# EAGLE design FizziLagTester (EAGLE 7.5.0)
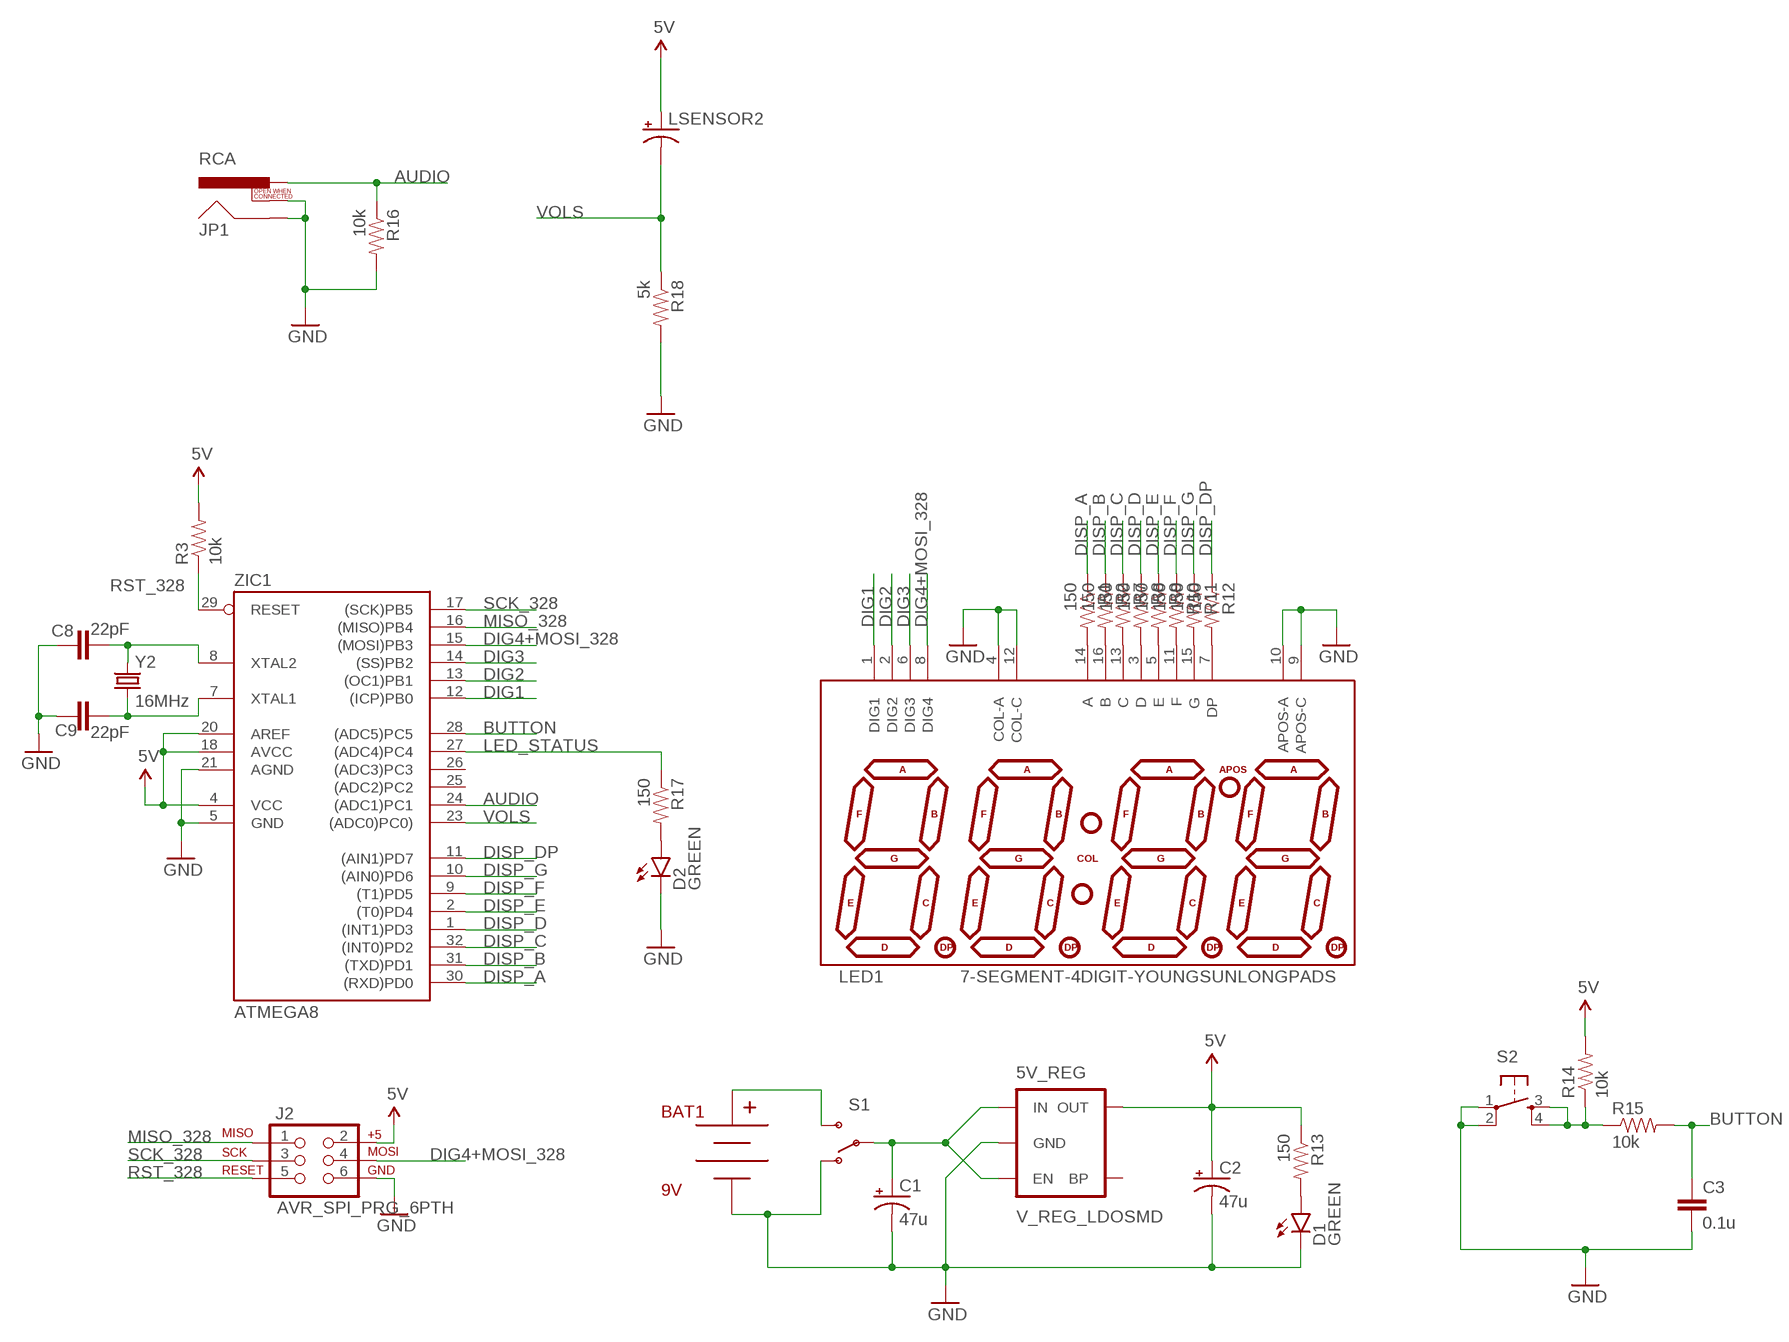
[diagram p0: schematic, sheet 1]

## Parts
5V_REG  V_REG_LDOSMD  [SOT23-5]
BAT1  9V  BC9VPC  [BC9VPC]
C1  47u  CAP_POLPTH1  [CPOL-RADIAL-100UF-25V]
C2  47u  CAP_POLPTH1  [CPOL-RADIAL-100UF-25V]
C3  0.1u  CAP0603-CAP  [0603-CAP]
C8  22pF  CAP0603-CAP  [0603-CAP]
C9  22pF  CAP0603-CAP  [0603-CAP]
D1  GREEN  LED-GREEN0603  [LED-0603]
D2  GREEN  LED-GREEN0603  [LED-0603]
J2  AVR_SPI_PRG_6PTH  [2X3]
JP1  RCA  [RCA]
LED1  7-SEGMENT-4DIGIT-YOUNGSUNLONGPADS  [7-SEGMENT-4DIGIT-YOUNGSUN-LONGPADS]
LSENSOR2  CAP_POLPTH2  [CPOL-RADIAL-10UF-25V]
R1  150  RESISTOR0603-RES  [0603-RES]
R2  150  RESISTOR0603-RES  [0603-RES]
R3  10k  RESISTOR0603-RES  [0603-RES]
R7  150  RESISTOR0603-RES  [0603-RES]
R8  150  RESISTOR0603-RES  [0603-RES]
R9  150  RESISTOR0603-RES  [0603-RES]
R10  150  RESISTOR0603-RES  [0603-RES]
R11  150  RESISTOR0603-RES  [0603-RES]
R12  150  RESISTOR0603-RES  [0603-RES]
R13  150  RESISTOR0603-RES  [0603-RES]
R14  10k  RESISTOR0603-RES  [0603-RES]
R15  10k  RESISTOR0603-RES  [0603-RES]
R16  10k  RESISTOR0603-RES  [0603-RES]
R17  150  RESISTOR0603-RES  [0603-RES]
R18  5k  RESISTOR0603-RES  [0603-RES]
S1  SWITCH-SPDTPTH  [SWITCH-SPDT]
S2  TAC_SWITCHPTH  [TACTILE-PTH]
Y2  16MHz  CRYSTALHC49US  [HC49US]
ZIC1  ATMEGA8  AT90S4433A  [TQFP32-08]

## Nets
5V: 5V_REG.5(OUT) C2.1(+) J2.2 LSENSOR2.1(+) R3.2 R13.1 R14.2 ZIC1.4(VCC) ZIC1.18(AVCC) ZIC1.20(AREF)
AUDIO: JP1.PIN R16.1 ZIC1.24((ADC1)PC1)
BUTTON: C3.1 R15.2 ZIC1.28((ADC5)PC5)
DIG1: LED1.1(DIG1) ZIC1.12((ICP)PB0)
DIG2: LED1.2(DIG2) ZIC1.13((OC1)PB1)
DIG3: LED1.6(DIG3) ZIC1.14((SS)PB2)
DIG4+MOSI_328: J2.4 LED1.8(DIG4) ZIC1.15((MOSI)PB3)
DISP_A: R1.1 ZIC1.30((RXD)PD0)
DISP_B: R2.1 ZIC1.31((TXD)PD1)
DISP_C: R7.1 ZIC1.32((INT0)PD2)
DISP_D: R8.1 ZIC1.1((INT1)PD3)
DISP_DP: R12.1 ZIC1.11((AIN1)PD7)
DISP_E: R9.1 ZIC1.2((T0)PD4)
DISP_F: R10.1 ZIC1.9((T1)PD5)
DISP_G: R11.1 ZIC1.10((AIN0)PD6)
GND: 5V_REG.2(GND) BAT1.V- C1.2(-) C2.2(-) C3.2 C8.2 C9.2 D1.C D2.C J2.6 JP1.SHELL JP1.SWITCH LED1.4(COL-A) LED1.9(APOS-C) LED1.10(APOS-A) LED1.12(COL-C) R16.2 R18.2 S1.1(O) S2.1 S2.2 ZIC1.5(GND) ZIC1.21(AGND)
LED_STATUS: R17.1 ZIC1.27((ADC4)PC4)
MISO_328: J2.1 ZIC1.16((MISO)PB4)
N$1: LED1.14(A) R1.2
N$2: LED1.16(B) R2.2
N$3: C8.1 Y2.2 ZIC1.8(XTAL2)
N$4: C9.1 Y2.1 ZIC1.7(XTAL1)
N$5: LED1.13(C) R7.2
N$6: LED1.3(D) R8.2
N$7: LED1.5(E) R9.2
N$8: LED1.11(F) R10.2
N$9: LED1.15(G) R11.2
N$12: LED1.7(DP) R12.2
N$13: BAT1.V+ S1.3(S)
N$14: 5V_REG.1(IN) 5V_REG.3(EN) C1.1(+) S1.2(P)
N$15: D1.A R13.2
N$16: R14.1 R15.1 S2.3 S2.4
N$18: D2.A R17.2
RST_328: J2.5 R3.1 ZIC1.29(RESET)
SCK_328: J2.3 ZIC1.17((SCK)PB5)
VOLS: LSENSOR2.2(-) R18.1 ZIC1.23((ADC0)PC0))
Unconnected: 5V_REG.4(BP) ZIC1.25((ADC2)PC2) ZIC1.26((ADC3)PC3)

## Library data of the parts
5V_REG = SparkFun-PowerIC:V_REG_LDO: Voltage Regulator LDO Standard 150mA LDO voltage regulator in SOT-23 layout. Micrel part MIC5205. BP (by-pass) pin is used to lower output noise with 470pF cap.
BAT1 = SparkFun-Connectors:BC9VPC: 9V board-mount battery cradle
C1 C2 LSENSOR2 = SparkFun-Capacitors:CAP_POL: Capacitor Polarized These are standard SMD and PTH capacitors. Normally 10uF, 47uF, and 100uF in electrolytic and tantalum varieties. Always verify the external diameter of the through hole cap, it varies with capacity, voltage, and manufacturer. The EIA devices should be standard.
C3 = SparkFun-Capacitors:CAP: Capacitor Standard 0603 ceramic capacitor, and 0.1" leaded capacitor.
C8 C9 = SparkFun:CAP: Capacitor Standard 0603 ceramic capacitor, and 0.1" leaded capacitor.
D1 D2 = SparkFun-LED:LED-GREEN: Various green LEDs Green LEDs used in SFE Production 0603- DIO-00821 LARGE- DIO-00862 LILYPAD- DIO-09910; PROD_ID: DIO-00821
J2 = SparkFun:AVR_SPI_PRG_6: AVR ISP 6 Pin This is the reduced ISP connector for AVR programming. Common on Arduino. This footprint will take up less PCB space and can be used with a 10-pin to 6-pin adapter such as SKU: BOB-08508
JP1 = SparkFun-Connectors:RCA
LED1 = SparkFun-Displays:7-SEGMENT-4DIGIT-YOUNGSUN: This is a part for the 4-Digit 7-segment LEDs from Young Sun. Different from the Digikey LEDs, all 16 pins are used. The LONGPADS Variant is used for a test jig, but you may like it because there is more pad to solder to. If you are concerned about routing space, the standard works just fine though.
R1 R2 R7-R18 = SparkFun-Passives:RESISTOR: Resistor Basic schematic elements and footprints for 0603, 1206, and PTH resistors.
R3 = SparkFun:RESISTOR: Resistor Basic schematic elements and footprints for 0603, 1206, and PTH resistors.
S1 = SparkFun-Electromechanical:SWITCH-SPDT: SPDT Switch Simple slide switch, Spark Fun Electronics SKU : COM-00102 DPDT SMT slide switch, AYZ0202, SWCH-08179
S2 = SparkFun-Electromechanical:TAC_SWITCH: Momentary Switch Button commonly used for reset or general input. Spark Fun Electronics SKU : COM-00097 SMT- SWCH-08247
Y2 = SparkFun:CRYSTAL: Crystals Various standard crystals. Proven footprints. Spark Fun Electronics SKU : COM-00534
ZIC1 = atmel:AT90S4433: MICROCONTROLLER 4 Kbytes FLASH 128 bytes SRAM 256 bytes EEPROM UART 6-channel 10 bit ADC

## Net classes
0 default: width 0.203 mm, clearance 0.203 mm

## Board
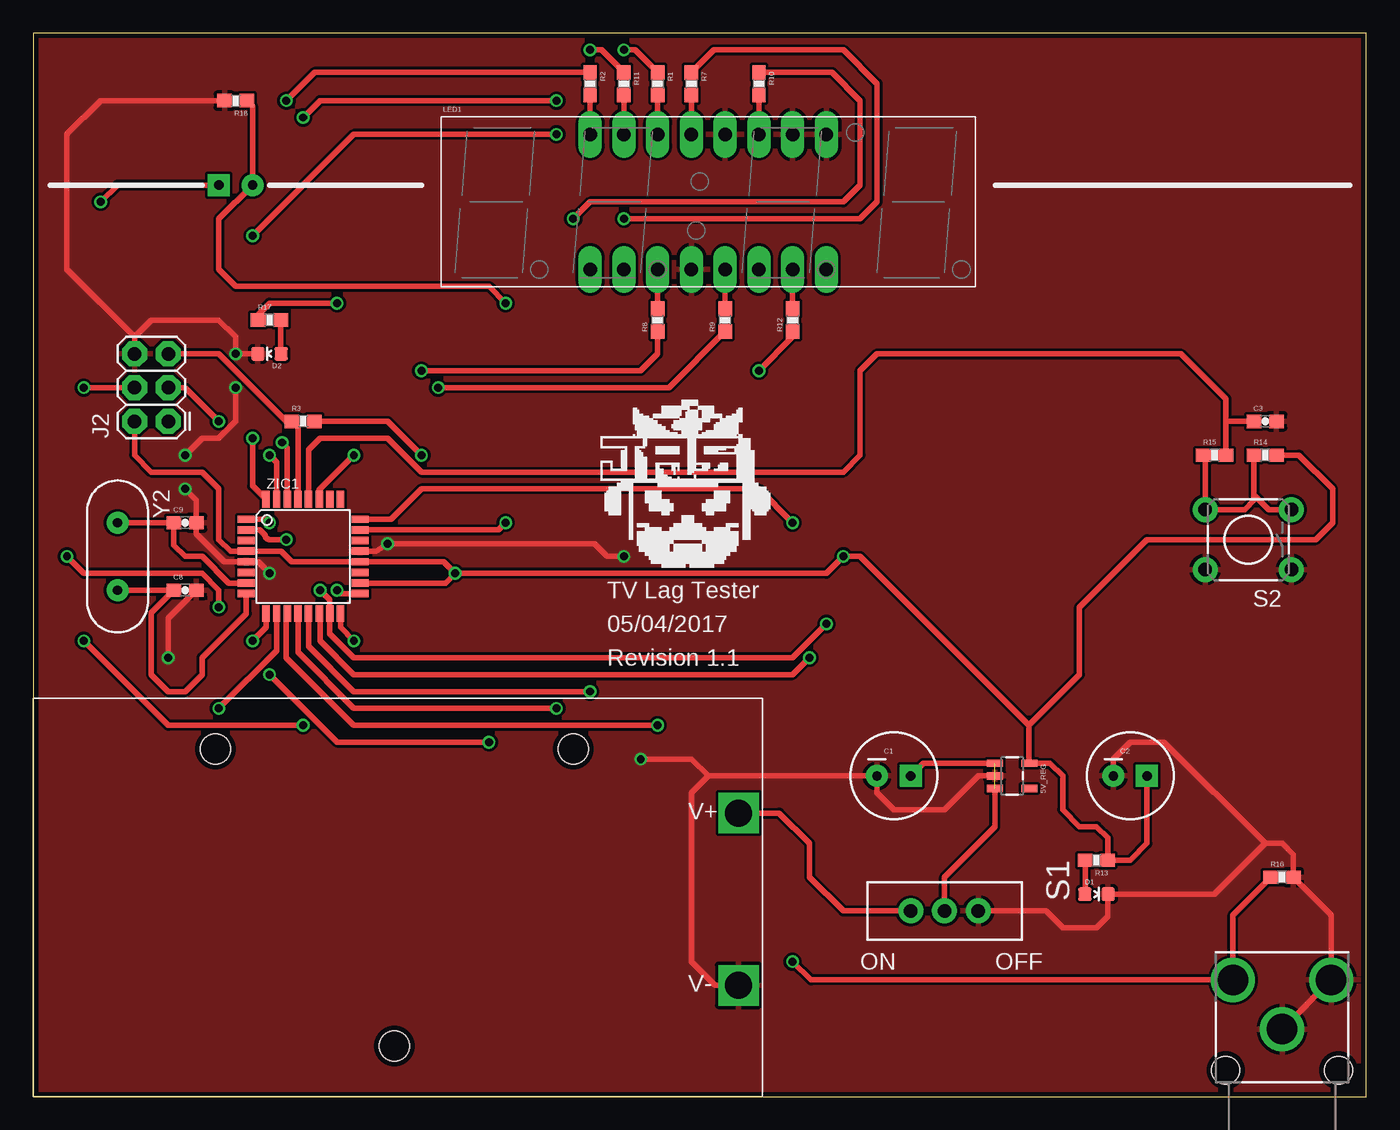
[diagram p1: board, top side]
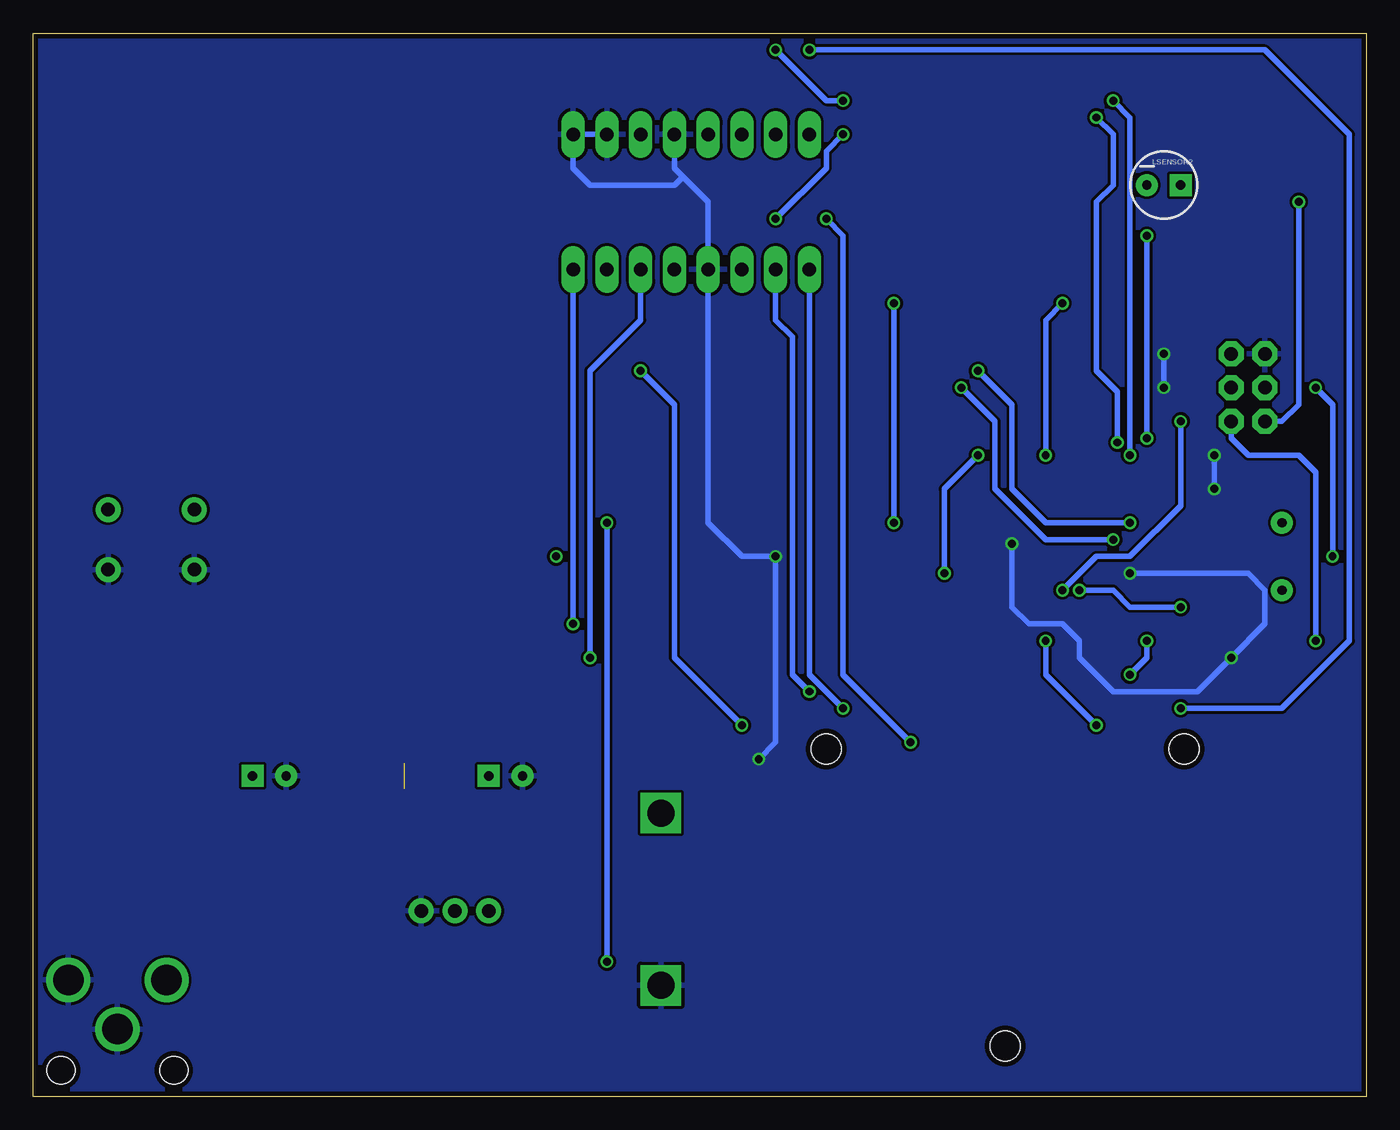
[diagram p2: board, bottom side, seen from below]

Size 100.32 x 80 mm. Coordinates in mm from the lower left corner, seen from the top.
Outline: 0,0 100.32,0 100.32,80 0,80 0,0
Copper layers (1*16): Top 0.0356mm / dielectric 1.5011mm / Bottom 0.0356mm
Design rules "LaenPCBOrder": minimum track width 6mil, minimum drill 13mil, track to track 6mil, track to pad 6mil, pad to pad 6mil, via to via 6mil, smd to smd 6mil, copper to edge 15mil, drill to drill 6mil, minimum pad ring 7mil, minimum via ring 7mil, stop-mask expansion 4mil, vias tented up to drill 0mil, thermal gap 10mil

### Footprints (pad centres in the part's own frame; a part is rotated, then mirrored left to right if it is on the bottom)
SOT23-5 = smd 0.55 x 1.2: 1 -0.95,-1.3; 2 0,-1.3; 3 0.95,-1.3; 4 0.95,1.3; 5 -0.95,1.3
BC9VPC = drill 2.032 square: V+ 53.086,21.336; V- 53.086,8.382 | hole 2.286: 27.178,3.81; 13.716,26.162; 40.64,26.162
CPOL-RADIAL-100UF-25V = drill 0.7 pad 1.651 square: 1 1.27,0 | drill 0.7 pad 1.651: 2 -1.27,0
0603-CAP = smd 1.1 x 1: 1 -0.85,0; 2 0.85,0
LED-0603 = smd 1 x 1: A 0,-0.877; C 0,0.877
2X3 = drill 1.016 pad 1.88 octagon: 1 0,0; 2 0,2.54; 3 2.54,0; 4 2.54,2.54; 5 5.08,0; 6 5.08,2.54
RCA = drill 2.3: PIN 3.7,3.7; SHELL 0,0; SWITCH 3.7,-3.7 | hole 2.1: -3.1,4.25; -3.1,-4.25
7-SEGMENT-4DIGIT-YOUNGSUN-LONGPADS = drill 1.016 pad 1.778 long: 1 -8.89,-5.08; 2 -6.35,-5.08; 3 -3.81,-5.08; 4 -1.27,-5.08; 5 1.27,-5.08; 6 3.81,-5.08; 7 6.35,-5.08; 8 8.89,-5.08; 9 8.89,5.08; 10 6.35,5.08; 11 3.81,5.08; 12 1.27,5.08; 13 -1.27,5.08; 14 -3.81,5.08; 15 -6.35,5.08; 16 -8.89,5.08
CPOL-RADIAL-10UF-25V = drill 0.7 pad 1.651 square: 1 1.27,0 | drill 0.7 pad 1.651: 2 -1.27,0
0603-RES = smd 1.1 x 1: 1 -0.85,0; 2 0.85,0
SWITCH-SPDT = drill 1.016 pad 1.88: 1 0,2.54; 2 0,0; 3 0,-2.54
TACTILE-PTH = drill 1.016 pad 1.88: 1 -3.251,2.261; 2 3.251,2.261; 3 -3.251,-2.261; 4 3.251,-2.261
HC49US = drill 0.7 pad 1.651: 1 -2.54,0; 2 2.54,0
TQFP32-08 = smd 1.27 x 0.559: 1 -4.293,2.8; 2 -4.293,2; 3 -4.293,1.2; 4 -4.293,0.4; 5 -4.293,-0.4; 6 -4.293,-1.2; 7 -4.293,-2; 8 -4.293,-2.8; 17 4.293,-2.8; 18 4.293,-2; 19 4.293,-1.2; 20 4.293,-0.4; 21 4.293,0.4; 22 4.293,1.2; 23 4.293,2; 24 4.293,2.8 | smd 0.559 x 1.27: 9 -2.8,-4.293; 10 -2,-4.293; 11 -1.2,-4.293; 12 -0.4,-4.293; 13 0.4,-4.293; 14 1.2,-4.293; 15 2,-4.293; 16 2.8,-4.293; 25 2.8,4.293; 26 2,4.293; 27 1.2,4.293; 28 0.4,4.293; 29 -0.4,4.293; 30 -1.2,4.293; 31 -2,4.293; 32 -2.8,4.293

### Placement (x,y rotation side)
5V_REG  73.66,24.13 270 top
BAT1  0,0 0 top
C1  64.77,24.13 0 top
C2  82.55,24.13 0 top
C3  92.71,50.8 0 top
C8  11.43,38.1 0 top
C9  11.43,43.18 0 top
D1  80.01,15.24 270 top
D2  17.78,55.88 90 top
J2  10.16,50.8 90 top
JP1  93.98,5.08 90 top
LED1  50.8,67.31 0 top
LSENSOR2  15.24,68.58 0 bottom
R1  46.99,76.2 270 top
R2  41.91,76.2 270 top
R3  20.32,50.8 0 top
R7  49.53,76.2 270 top
R8  46.99,58.42 90 top
R9  52.07,58.42 90 top
R10  54.61,76.2 270 top
R11  44.45,76.2 270 top
R12  57.15,58.42 90 top
R13  80.01,17.78 180 top
R14  92.71,48.26 0 top
R15  88.9,48.26 0 top
R16  93.98,16.51 0 top
R17  17.78,58.42 0 top
R18  15.24,74.93 180 top
S1  68.58,13.97 270 top
S2  91.44,41.91 180 top
Y2  6.35,40.64 270 top
ZIC1  20.32,40.64 0 top

### Tracks (layer width: path | path; a pad name or v marks a point on that pad's centre or on a via)
5V  (via drill 0.6)
  Top 0.406: J2.2 7.62,48.26 8.89,46.99 12.7,46.99 13.97,45.72 13.97,41.91 14.84,41.04 ZIC1.4 18.65,41.04 19.45,40.24 ZIC1.20 30.88,40.24 v31.75,39.37 | LSENSOR2.1 6.35,68.58 v5.08,67.31 | R3.2 26.67,50.8 v29.21,48.26 | 74.93,27.94 74.93,25.11 5V_REG.5 76.52,25.08 77.47,24.13 77.47,21.59 78.74,20.32 80.01,20.32 80.86,19.47 R13.1 82.55,17.78 83.82,19.05 C2.1 | R14.2 95.25,48.26 97.79,45.72 97.79,43.18 96.52,41.91 83.82,41.91 78.74,36.83 78.74,31.75 74.93,27.94 | v31.75,39.37 31.02,38.64 ZIC1.18 | v31.75,39.37 59.69,39.37 v60.96,40.64 62.23,40.64 74.93,27.94
  Bottom 0.406: v5.08,67.31 5.08,52.07 6.35,50.8 J2.2 | v29.21,48.26 31.75,45.72 v31.75,39.37
AUDIO  (via drill 0.6)
  Top 0.406: v57.15,10.16 58.53,8.78 JP1.PIN 90.28,13.66 R16.1 | v57.15,43.18 54.61,45.72 29.21,45.72 26.93,43.44 ZIC1.24
  Bottom 0.406: v57.15,10.16 v57.15,43.18
BUTTON
  Top 0.406: ZIC1.28 20.72,48.66 21.59,49.53 26.67,49.53 29.21,46.99 60.96,46.99 62.23,48.26 62.23,54.61 63.5,55.88 86.36,55.88 89.75,52.49 89.75,50.8 | 89.75,50.8 R15.2 | C3.1 89.75,50.8
DIG1  (via drill 0.6)
  Top 0.406: v39.37,29.21 24.13,29.21 19.92,33.42 ZIC1.12
  Bottom 0.406: LED1.1 41.91,31.75 v39.37,29.21
DIG2  (via drill 0.6)
  Top 0.406: ZIC1.13 20.72,33.89 24.13,30.48 v41.91,30.48
  Bottom 0.406: v41.91,30.48 43.18,31.75 43.18,57.15 44.45,58.42 LED1.2
DIG3  (via drill 0.6)
  Top 0.406: ZIC1.14 21.59,36.28 21.59,34.29 24.13,31.75 57.15,31.75 v58.42,33.02
  Bottom 0.406: v58.42,33.02 58.42,54.61 54.61,58.42 LED1.6
DIG4+MOSI_328  (via drill 0.6)
  Top 0.406: v59.69,35.56 57.15,33.02 24.13,33.02 22.32,34.83 ZIC1.15 22.32,37.37 v21.59,38.1 | v2.54,40.64 3.81,39.37 12.7,39.37 13.97,38.1 v13.97,36.83 | v3.81,53.34 J2.4
  Bottom 0.406: LED1.8 v59.69,35.56 | v2.54,40.64 2.54,52.07 v3.81,53.34 | v13.97,36.83 17.78,36.83 19.05,38.1 v21.59,38.1
DISP_A  (via drill 0.6)
  Top 0.406: R1.1 45.3,78.74 v44.45,78.74 | v39.37,74.93 21.59,74.93 v20.32,73.66 | ZIC1.30 19.12,48.83 v18.73,49.21
  Bottom 0.406: v44.45,78.74 40.64,74.93 v39.37,74.93 | v20.32,73.66 19.05,72.39 19.05,68.58 20.32,67.31 20.32,54.61 18.73,53.02 v18.73,49.21
DISP_B  (via drill 0.6)
  Top 0.406: R2.1 21.17,77.05 v19.05,74.93 | v17.78,48.26 18.32,47.72 ZIC1.31
  Bottom 0.406: v19.05,74.93 17.78,73.66 v17.78,48.26
DISP_C  (via drill 0.6)
  Top 0.406: v39.37,72.39 24.13,72.39 v16.51,64.77 | v16.51,49.53 16.51,45.94 ZIC1.32 | R7.1 51.22,78.74 60.96,78.74 63.5,76.2 63.5,67.31 62.23,66.04 v44.45,66.04
  Bottom 0.406: v16.51,64.77 v16.51,49.53 | v44.45,66.04 40.64,69.85 40.64,71.12 v39.37,72.39
DISP_D  (via drill 0.6)
  Top 0.406: R8.1 46.99,55.88 45.72,54.61 v29.21,54.61 | v17.78,43.18 17.52,43.44 ZIC1.1
  Bottom 0.406: v29.21,54.61 26.67,52.07 26.67,45.72 24.13,43.18 v17.78,43.18
DISP_DP  (via drill 0.6)
  Top 0.406: ZIC1.11 19.05,36.28 19.05,33.02 24.13,27.94 v46.99,27.94 | v54.61,54.61 57.15,57.15 R12.1
  Bottom 0.406: v46.99,27.94 52.07,33.02 52.07,52.07 v54.61,54.61
DISP_E  (via drill 0.6)
  Top 0.406: R9.1 47.84,53.34 v30.48,53.34 | v19.05,41.91 17.78,41.91 arc-90 17.46,42.23 17.05,42.64 ZIC1.2
  Bottom 0.406: v30.48,53.34 27.94,50.8 27.94,45.72 24.13,41.91 v19.05,41.91
DISP_F  (via drill 0.6)
  Top 0.406: v16.51,34.29 17.52,35.3 ZIC1.9 | v17.78,31.75 22.86,26.67 v34.29,26.67 | R10.1 60.11,77.05 62.23,74.93 62.23,68.58 60.96,67.31 41.91,67.31 v40.64,66.04
  Bottom 0.406: v34.29,26.67 39.37,31.75 39.37,64.77 v40.64,66.04 | v17.78,31.75 16.51,33.02 v16.51,34.29
DISP_G  (via drill 0.6)
  Top 0.406: ZIC1.10 18.32,33.56 v13.97,29.21 | v41.91,78.74 42.76,78.74 R11.1
  Bottom 0.406: v13.97,29.21 6.35,29.21 1.27,34.29 1.27,72.39 7.62,78.74 v41.91,78.74
GND  (via drill 0.6)
  Top 0.406: v11.43,45.72 12.28,44.87 C9.2 12.28,42.33 14.37,40.24 ZIC1.5 16.91,40.24 v17.78,39.37 | v11.43,48.26 12.7,49.53 13.97,49.53 15.24,50.8 v15.24,53.34 | D2.C v15.24,55.88 15.24,57.15 13.97,58.42 8.89,58.42 7.62,57.15 | J2.6 7.62,57.15 | C8.2 10.16,35.98 v10.16,33.02 | ZIC1.21 25.8,41.04 v26.67,41.59 42.23,41.59 43.18,40.64 v44.45,40.64 | R18.2 5.08,74.93 2.54,72.39 2.54,62.23 7.62,57.15 | BAT1.V- 51.31,8.38 49.53,10.16 49.53,22.86 50.8,24.13 | 50.8,24.13 C1.2 63.5,22.86 64.77,21.59 68.58,21.59 71.12,24.13 5V_REG.2 | S1.1 76.2,13.97 77.47,12.7 80.01,12.7 80.89,13.58 D1.C 88.9,15.24 92.71,19.05 | 92.71,19.05 93.98,19.05 94.83,18.2 R16.2 97.68,13.66 JP1.SWITCH JP1.SHELL | 50.8,24.13 49.53,25.4 v45.72,25.4 | C2.2 81.28,25.4 82.55,26.67 85.09,26.67 92.71,19.05
  Bottom 0.406: v11.43,45.72 v11.43,48.26 | v15.24,53.34 v15.24,55.88 | v26.67,41.59 26.67,36.83 25.4,35.56 22.86,35.56 21.59,34.29 21.59,33.02 19.05,30.48 12.7,30.48 v10.16,33.02 7.62,35.56 7.62,38.1 8.89,39.37 v17.78,39.37 | 51.44,69.22 49.53,67.31 LED1.4 49.53,43.18 46.99,40.64 v44.45,40.64 44.45,26.67 v45.72,25.4 | 51.44,69.22 52.07,69.85 LED1.12 | 51.44,69.22 52.07,68.58 58.42,68.58 59.69,69.85 LED1.9 LED1.10
  pour Bottom: 0,80.01 100.33,80.01 100.33,0 0,0
  pour Top: 0,80.01 100.33,80.01 100.33,1.27 100.33,0 0,0
LED_STATUS  (via drill 0.6)
  Top 0.406: R17.1 16.93,58.84 17.78,59.69 v22.86,59.69 | v24.13,48.26 21.52,45.65 ZIC1.27
  Bottom 0.406: v22.86,59.69 24.13,58.42 v24.13,48.26
MISO_328  (via drill 0.6)
  Top 0.406: ZIC1.16 23.12,35.3 v24.13,34.29 | v20.32,27.94 10.16,27.94 v3.81,34.29
  Bottom 0.406: v24.13,34.29 24.13,31.75 v20.32,27.94 | v3.81,34.29 3.81,46.99 5.08,48.26 8.89,48.26 10.16,49.53 J2.1
N$1
  Top 0.406: LED1.14 R1.2
N$2
  Top 0.406: LED1.16 R2.2
N$3
  Top 0.406: Y2.2 C8.1 8.89,36.41 8.89,31.75 10.16,30.48 11.43,30.48 12.7,31.75 12.7,33.02 16.03,36.35 ZIC1.8
N$4
  Top 0.406: Y2.1 C9.1 10.58,41.49 11.43,40.64 12.7,40.64 14.7,38.64 ZIC1.7
N$5
  Top 0.406: LED1.13 R7.2
N$6
  Top 0.406: R8.2 LED1.3
N$7
  Top 0.406: R9.2 LED1.5
N$8
  Top 0.406: LED1.11 R10.2
N$9
  Top 0.406: LED1.15 R11.2
N$12
  Top 0.406: R12.2 LED1.7
N$13
  Top 0.406: BAT1.V+ 56.13,21.34 58.42,19.05 58.42,16.51 60.96,13.97 S1.3
N$14  (1 unrouted)
  Top 0.406: S1.2 68.58,16.51 72.36,20.29 5V_REG.3 | C1.1 66.99,25.08 5V_REG.1
N$15
  Top 0.406: D1.A 79.16,15.24 R13.2
N$16
  Top 0.406: S2.3 92.99,44.17 91.86,45.3 R14.1 91.86,44.87 91.16,44.17 S2.4 88.19,48.12 R15.1
N$18
  Top 0.406: D2.A 18.63,55.88 R17.2
RST_328
  Top 0.406: J2.5 13.97,55.88 19.05,50.8 R3.1 19.92,50.35 ZIC1.29
SCK_328  (via drill 0.6)
  Top 0.406: ZIC1.17 23.12,37.84 v22.86,38.1 | v13.97,50.8 11.43,53.34 J2.3
  Bottom 0.406: v22.86,38.1 20.32,40.64 17.78,40.64 13.97,44.45 v13.97,50.8
VOLS  (via drill 0.6)
  Top 0.406: R18.1 16.51,74.51 LSENSOR2.2 13.97,66.04 13.97,62.23 15.24,60.96 34.29,60.96 v35.56,59.69 | ZIC1.23 35.02,42.64 v35.56,43.18
  Bottom 0.406: v35.56,59.69 v35.56,43.18

### Text on the board
tPlace: TV Lag Tester | 05/04/2017 | Revision 1.1 | ON | OFF